# EAGLE design station (EAGLE 9.0.1)
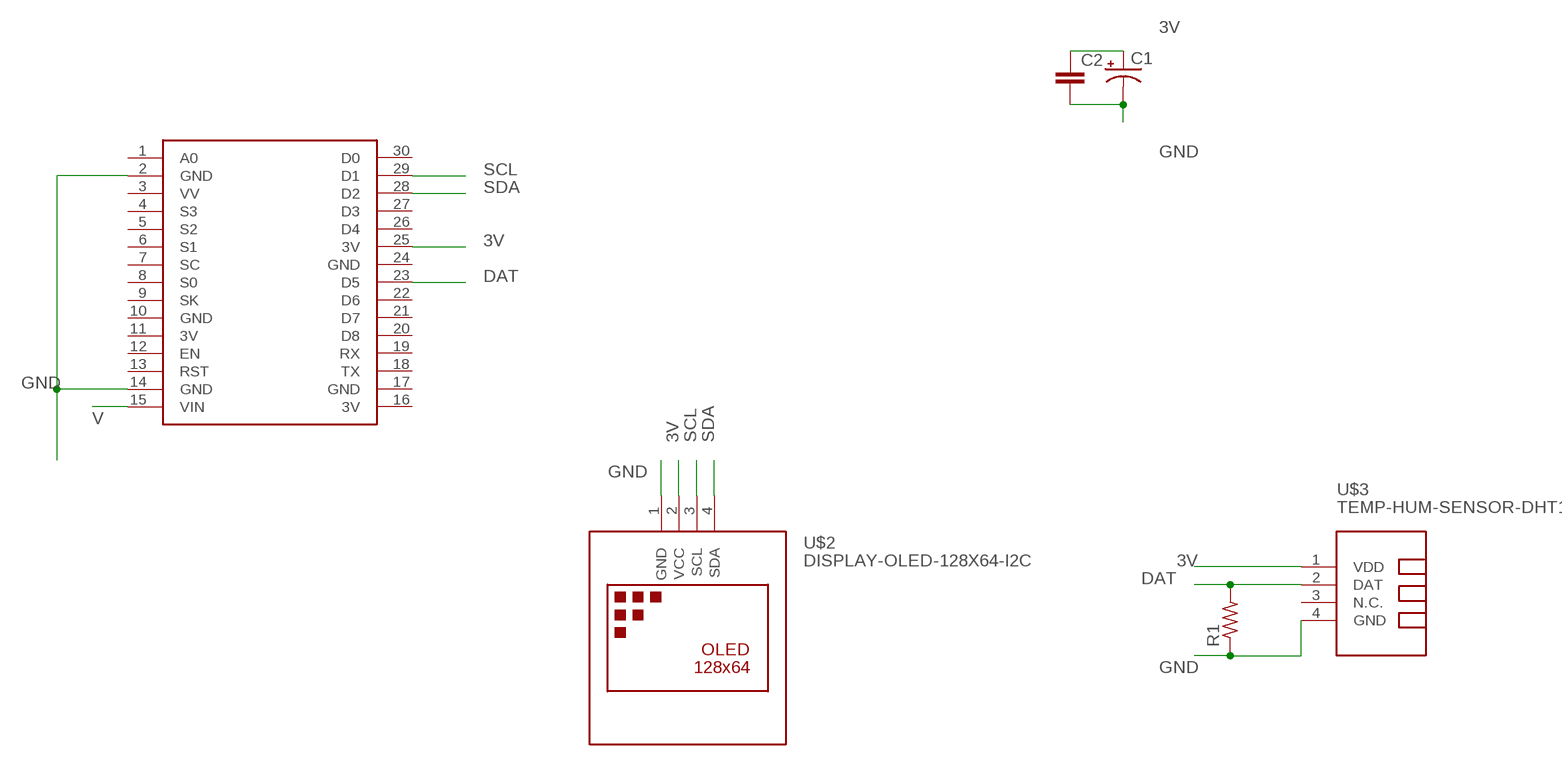
[diagram p0: schematic, sheet 1]

## Parts
C1  CPOL-USE5-5  [E5-5]
C2  C5/3  [C5B3]
R1  R-US_0207/7  [0207/7]
U$1  NODEMCU  [NODEMCU]
U$2  DISPLAY-OLED-128X64-I2C  [DISPLAY-OLED-128X64-I2C]
U$3  TEMP-HUM-SENSOR-DHT11  [TEMP-HUM-SENSOR-DHT11]

## Nets
3V: C1.+ C2.1 U$1.25(3V) U$2.2(VCC) U$3.1(VDD)
DAT: R1.2 U$1.23(D5) U$3.2(DAT)
GND: C1.- C2.2 R1.1 U$1.2(GND) U$1.14(GND) U$2.1(GND) U$3.4(GND)
SCL: U$1.29(D1) U$2.3(SCL)
SDA: U$1.28(D2) U$2.4(SDA)
V: U$1.15(VIN)
Unconnected: U$1.1(A0) U$1.3(VV) U$1.4(S3) U$1.5(S2) U$1.6(S1) U$1.7(SC) U$1.8(S0) U$1.9(SK) U$1.12(EN) U$1.13(RST) U$1.18(TX) U$1.19(RX) U$1.20(D8) U$1.21(D7) U$1.22(D6) U$1.26(D4) U$1.27(D3) U$1.30(D0) U$3.3(N.C.)

## Power pins joined to a net without a drawn wire
3V: U$1.11(3V) U$1.16(3V)
GND: U$1.10(GND) U$1.17(GND) U$1.24(GND)

## Library data of the parts
C1 = adafruit:CPOL-US: POLARIZED CAPACITOR, American symbol
C2 = capacitor-wima:C: CAPACITOR naming: grid - package width
R1 = adafruit:R-US_: RESISTOR, American symbol
U$1 = nodemcu:NODEMCU
U$2 = diy-modules:DISPLAY-OLED-128X64-I2C: 128x64 Dot Matrix OLED Module based on SSD1306 chip Variant with I2C interface More details available here: http://www.instructables.com/id/Monochrome-096-i2c-OLED-display-with-arduino-SSD13/ SSD1306 datasheet: https://cdn-shop.adafruit.com/datasheets/SSD1306.pdf Click here to find device on ebay.com <http://www.ebay.com/sch/oled+display+128x64+iic> Note: There are two variants: I2C and SPI. Search for the proper version.
U$3 = diy-modules:TEMP-HUM-SENSOR-DHT11: DHT11 - digital humidity & temperature sensor DHT11 datasheet available here: https://akizukidenshi.com/download/ds/aosong/DHT11.pdf Click here to find device on ebay.com <http://www.ebay.com/sch/dht11+digital+sensor>

## Board
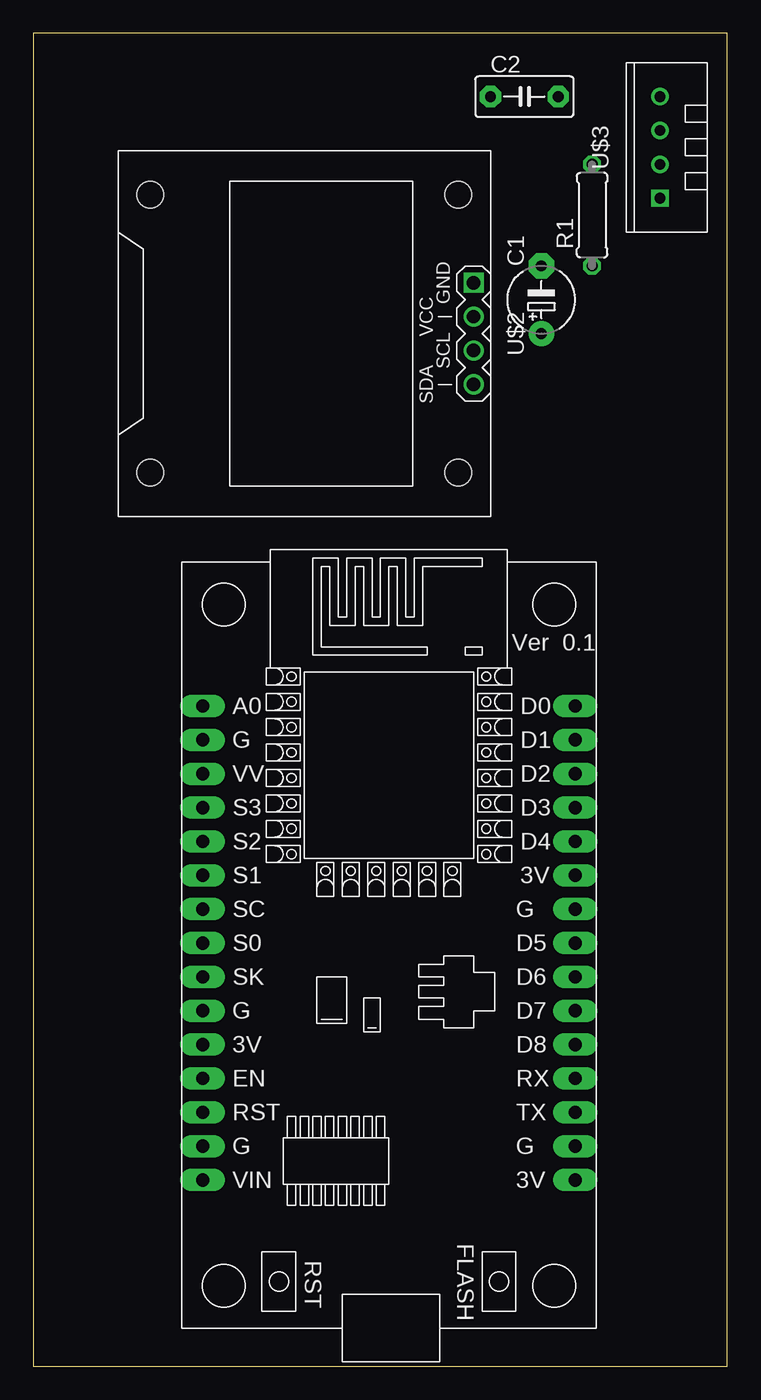
[diagram p1: board, top side]
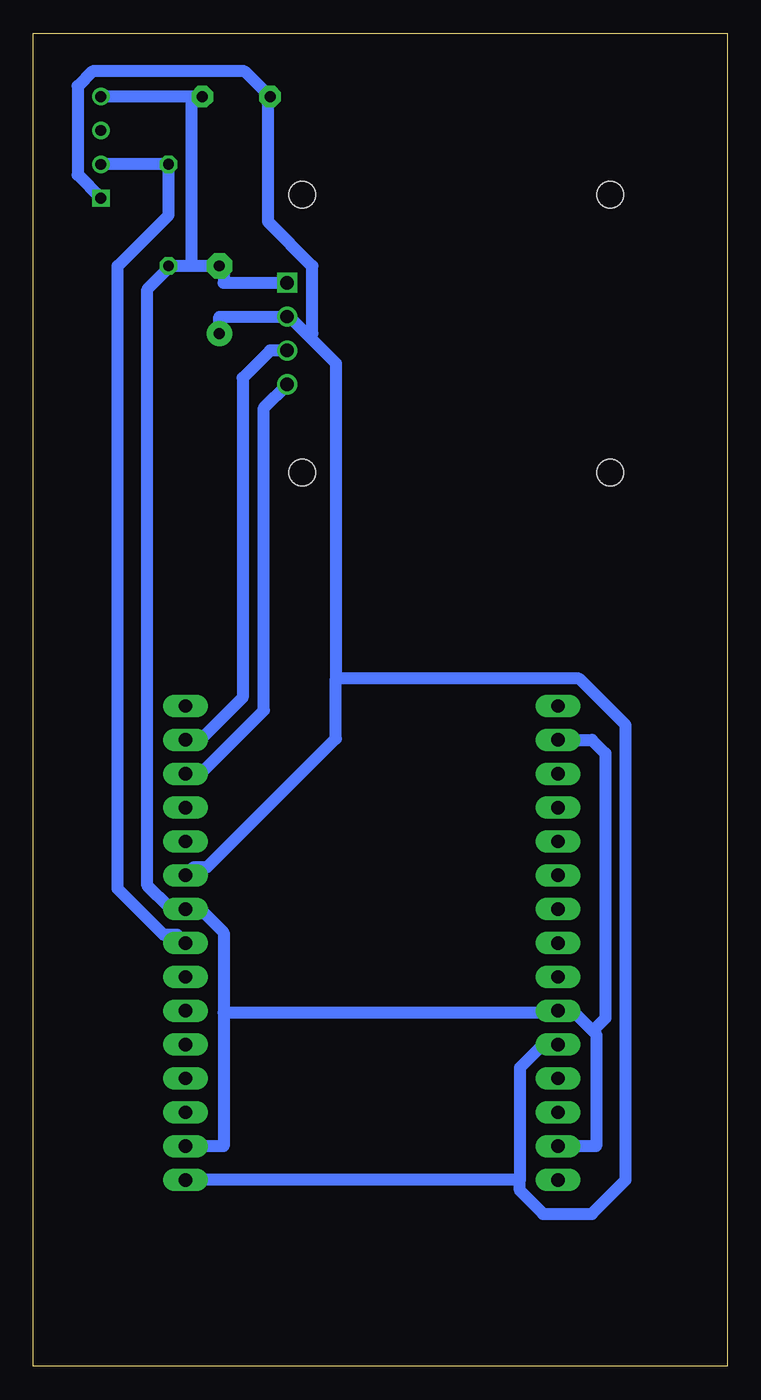
[diagram p2: board, bottom side, seen from below]

Size 52.05 x 100 mm. Coordinates in mm from the lower left corner, seen from the top.
Outline: 0,0 52.05,0 52.05,100 0,100 0,0
Copper layers (1*16): Top 0.035mm / dielectric 1.5mm / Bottom 0.035mm
Design rules "default *": minimum track width 35mil, minimum drill 0.35mm, track to track 25mil, track to pad 25mil, pad to pad 25mil, via to via 6mil, smd to smd 6mil, copper to edge 40mil, drill to drill 6mil, minimum pad ring 10mil, minimum via ring 8mil, stop-mask expansion 4mil, vias tented up to drill 0mil, thermal gap 10mil

### Footprints (pad centres in the part's own frame; a part is rotated, then mirrored left to right if it is on the bottom)
E5-5 = drill 0.813 pad 1.905: + -2.54,0 | drill 0.813 pad 1.905 octagon: - 2.54,0
C5B3 = drill 0.813 pad 1.6 octagon: 1 -2.54,0; 2 2.54,0
0207/7 = drill 0.813 octagon: 1 -3.81,0; 2 3.81,0
NODEMCU = drill 1 pad 1.676 long: 1 -13.97,17.78; 2 -13.97,15.24; 3 -13.97,12.7; 4 -13.97,10.16; 5 -13.97,7.62; 6 -13.97,5.08; 7 -13.97,2.54; 8 -13.97,0; 9 -13.97,-2.54; 10 -13.97,-5.08; 11 -13.97,-7.62; 12 -13.97,-10.16; 13 -13.97,-12.7; 14 -13.97,-15.24; 15 -13.97,-17.78; 16 13.97,-17.78; 17 13.97,-15.24; 18 13.97,-12.7; 19 13.97,-10.16; 20 13.97,-7.62; 21 13.97,-5.08; 22 13.97,-2.54; 23 13.97,0; 24 13.97,2.54; 25 13.97,5.08; 26 13.97,7.62; 27 13.97,10.16; 28 13.97,12.7; 29 13.97,15.24; 30 13.97,17.78
DISPLAY-OLED-128X64-I2C = drill 1 square: 1 -3.81,12.7 | drill 1: 2 -1.27,12.7; 3 1.27,12.7; 4 3.81,12.7 | hole 2: -10.414,11.557; 10.414,11.557; 10.414,-11.557; -10.414,-11.557
TEMP-HUM-SENSOR-DHT11 = drill 0.8 square: 1 -3.81,0 | drill 0.8: 2 -1.27,0; 3 1.27,0; 4 3.81,0

### Placement (x,y rotation side)
C1  38.1,80.01 90 top
C2  36.83,95.25 0 top
R1  41.91,86.36 90 top
U$1  26.67,31.75 0 top
U$2  20.32,77.47 270 top
U$3  46.99,91.44 90 top

### Tracks (layer width: path | path; a pad name or v marks a point on that pad's centre or on a via)
3V
  Bottom 0.889: 15.56,13.97 U$1.16 | 15.56,13.97 15.56,22.38 13.81,24.13 U$1.11 | U$3.1 48.74,89.38 48.74,96.04 47.62,97.16 36.2,97.16 C2.1 34.45,94.93 34.45,85.88 31.11,82.55 31.11,77.47 31.35,77.23 | C1.+ 38.1,78.74 U$2.2 32.7,78.58 31.35,77.23 | 29.37,51.59 29.37,75.25 31.35,77.23 | 15.56,13.97 15.56,13.18 13.81,11.43 10.16,11.43 7.62,13.97 7.62,48.1 11.11,51.59 29.37,51.59 | U$1.25 40.02,37.45 39.01,37.45 29.37,47.09 29.37,51.59
DAT
  Bottom 0.889: U$3.2 R1.2 41.91,86.36 45.72,82.55 45.72,35.82 42.27,32.37 41.26,32.37 U$1.23
GND
  Bottom 0.889: U$3.4 C2.2 40.16,94.93 40.16,82.55 | 40.16,82.55 C1.- 37.78,82.39 37.78,81.28 U$2.1 | 40.16,82.55 R1.1 42.07,82.23 43.5,80.8 43.5,36.04 41.91,34.45 40.96,34.45 U$1.24 39.53,34.29 37.78,32.54 37.78,26.51 | U$1.17 37.78,16.51 37.78,26.51 | U$1.14 9.84,16.51 9.84,24.92 10.08,25.16 | 10.08,25.16 11.59,26.67 U$1.10 13.02,26.51 37.78,26.51 | U$1.2 10.16,46.99 9.14,45.97 9.14,26.1 10.08,25.16
SCL
  Bottom 0.889: U$1.29 39.53,46.99 36.35,50.16 36.35,74.14 34.29,76.2 U$2.3
SDA
  Bottom 0.889: U$2.4 34.77,71.91 34.77,49.21 39.53,44.45 U$1.28